# EasyEDA Pro project ProProject_HV Display_2024-06-08.epro

# Schematic Schematic
Create Date: 2024-06-04; Page Name: P1; Project Name: HV Display; Schematic Name: Schematic; Update Date: 2024-06-07; Company: www.fiverr.com/yasirahmad159; Drawn: EasyEDA; Page Size: A4; Part Number: JLCPCB-002; Reviewed: EasyEDA; Version: V0.1
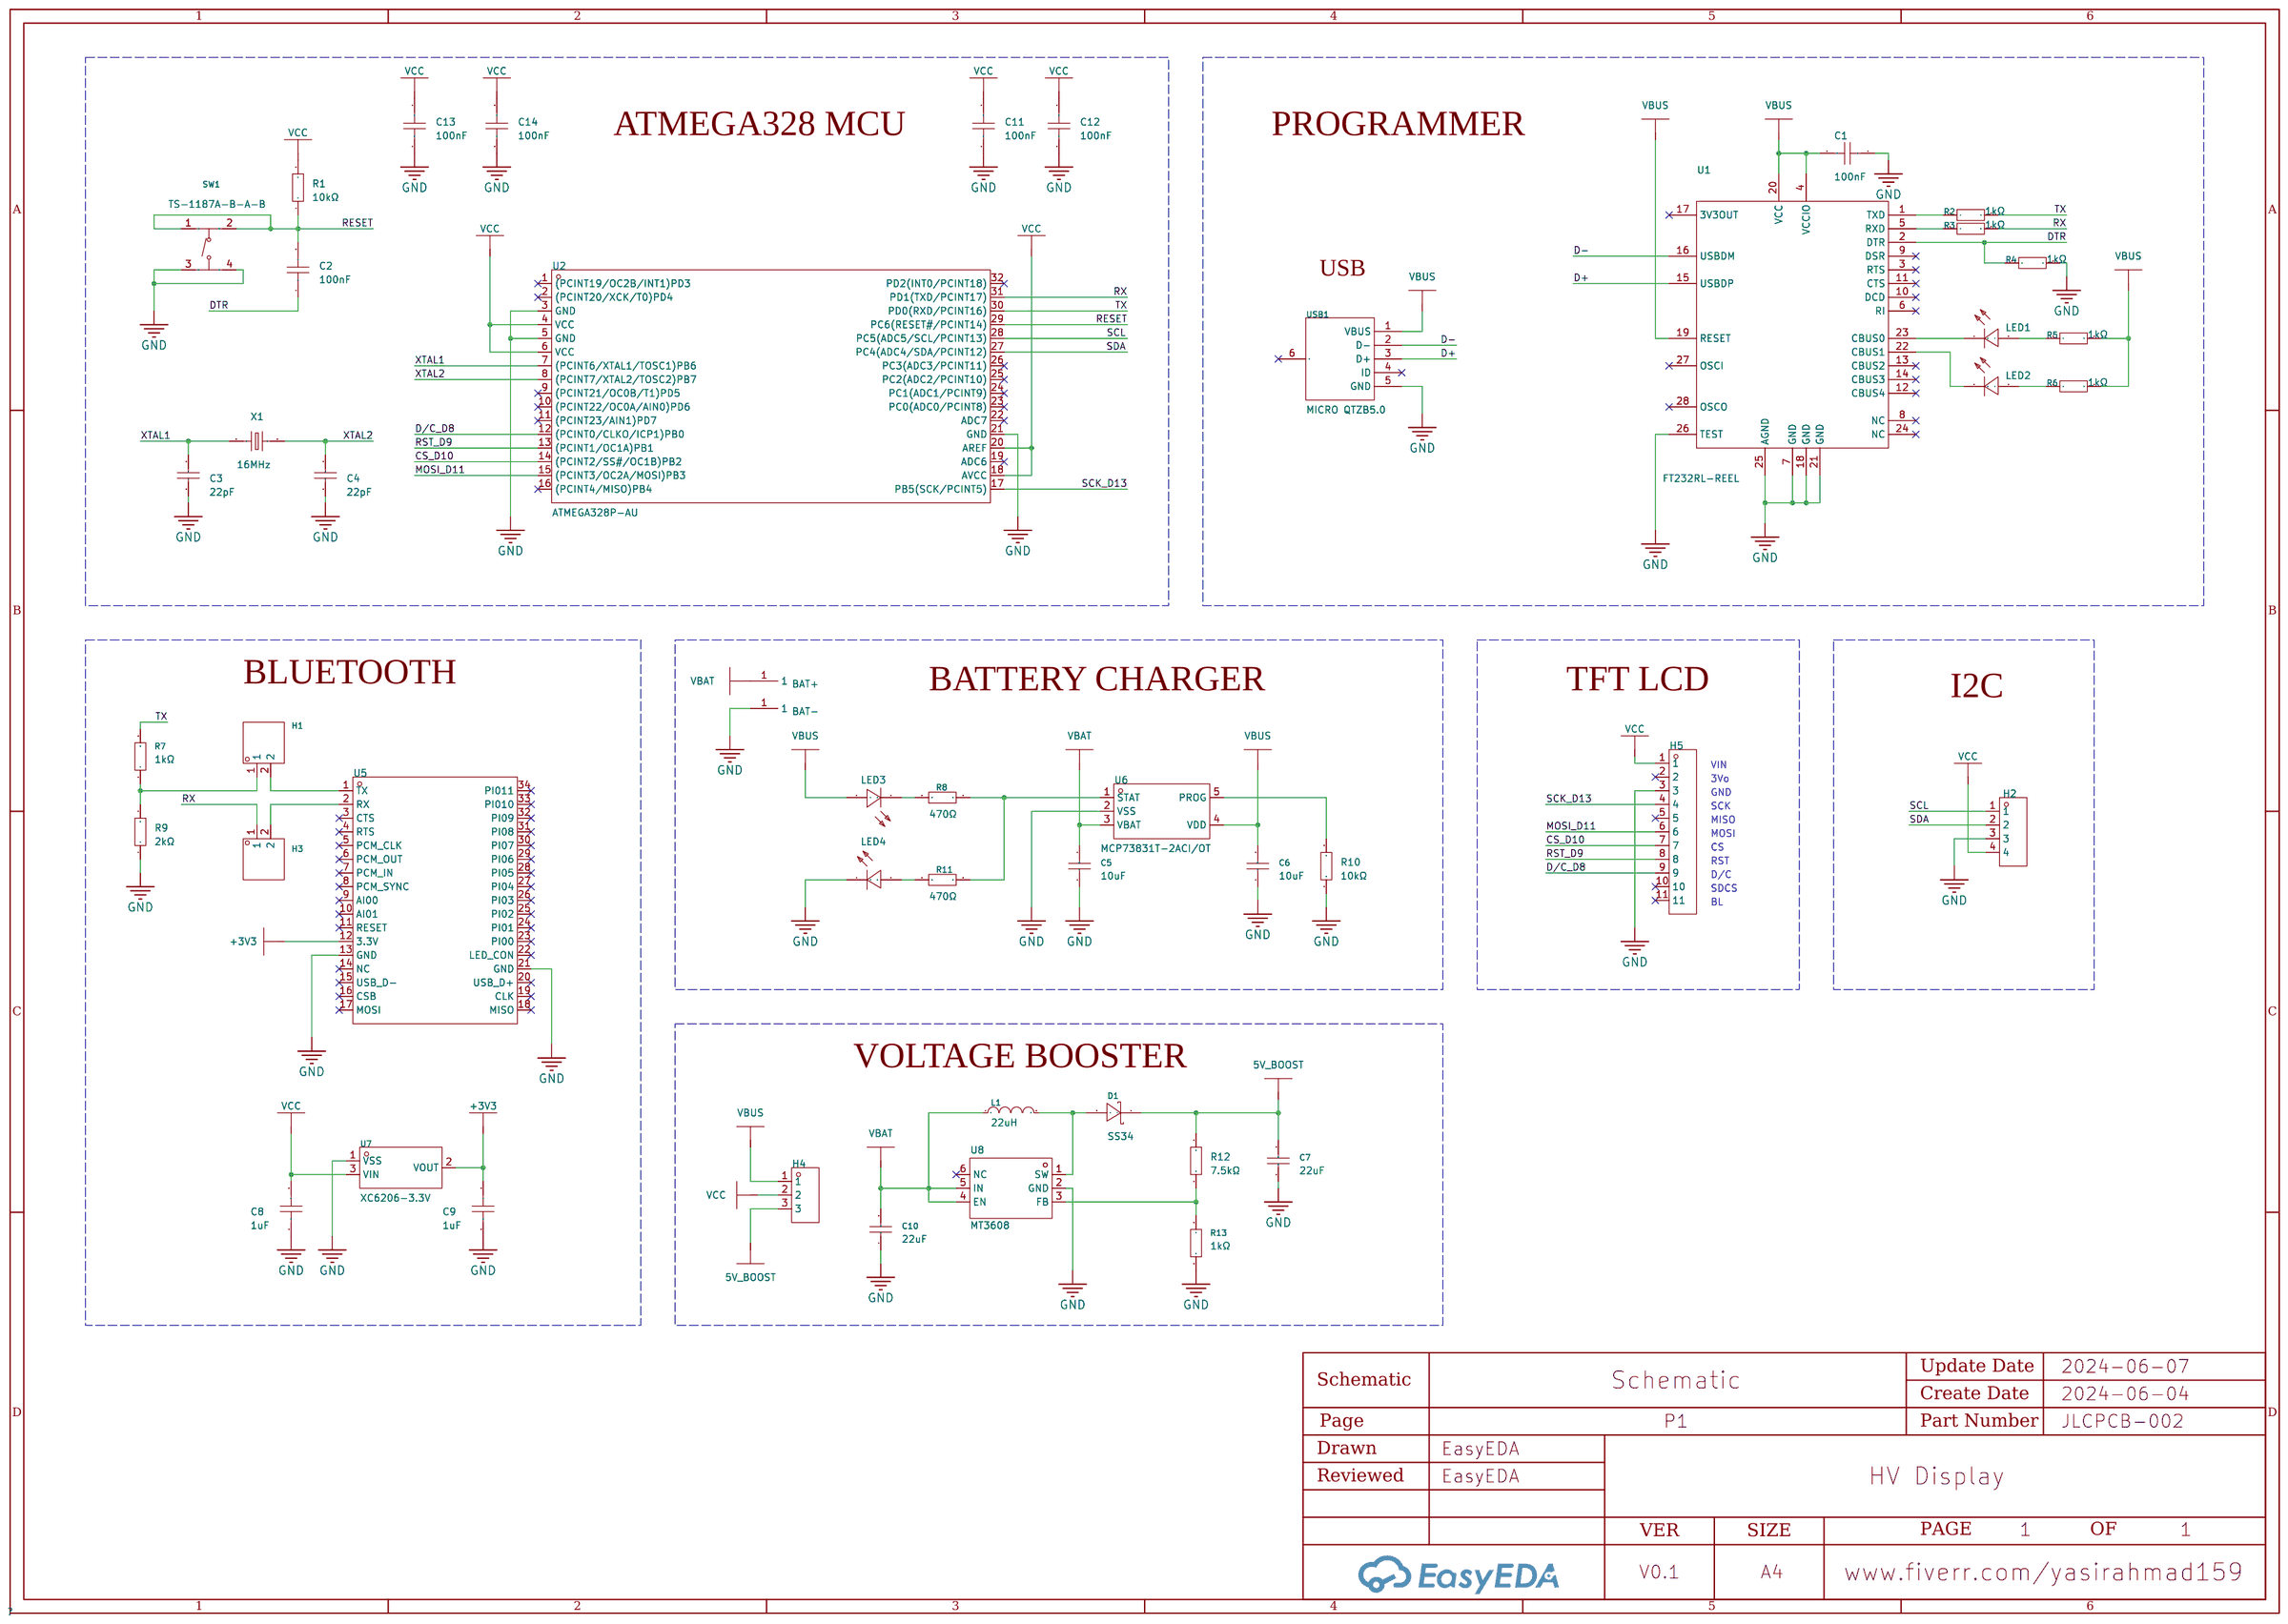
[diagram p0: schematic sheet]

## Parts
C1  100nF  [C0402]
C2  100nF  [C0402]
C3  22pF  [C0402]
C4  22pF  [C0402]
C5  10uF  [C0402]
C6  10uF  [C0402]
C7  22uF  [C1812]
C8  1uF  [C0402]
C9  1uF  [C0402]
C10  22uF  [C1812]
C11  100nF  [C0402]
C12  100nF  [C0402]
C13  100nF  [C0402]
C14  100nF  [C0402]
D1  SS34  [SMA_L4.3-W2.6-LS5.2-RD]
H1  -  [HDR-TH_2P-P2.54-V-M-1]
H2  -  [HDR-TH_4P-P2.54-V-M]
H3  -  [HDR-TH_2P-P2.54-V-M-1]
H4  -  [HDR-TH_3P-P2.54-V-M]
H5  -  [HDR-TH_11P-P2.54-V-M]
L1  22uH  [IND-SMD_L7.0-W6.8]
LED1  TJ-S1005SW4TGLC2R-A5  [LED0402-RD]
LED2  TJ-S1005SW4TGLC2R-A5  [LED0402-RD]
LED3  TJ-S1005SW4TGLC2R-A5  [LED0402-RD]
LED4  TJ-S1005SW4TGLC7K-A5  [LED0402-RD_GREEN]
R1  10kΩ  [R0402]
R2  1kΩ  [R0402]
R3  1kΩ  [R0402]
R4  1kΩ  [R0402]
R5  1kΩ  [R0402]
R6  1kΩ  [R0402]
R7  1kΩ  [R0402]
R8  470Ω  [R0402]
R9  2kΩ  [R0402]
R10  10kΩ  [R0402]
R11  470Ω  [R0402]
R12  7.5kΩ  [R0402]
R13  1kΩ  [R0402]
SW1  TS-1187A-B-A-B  [SW-SMD_4P-L5.1-W5.1-P3.70-LS6.5-TL-2]
U1  FT232RL-REEL  [SSOP-28_L10.2-W5.3-P0.65-LS7.8-BL]
U2  ATMEGA328P-AU  [TQFP-32_L7.0-W7.0-P0.80-LS9.0-BL]
U3  BAT+  [PKG-TEST-POINT-SMD_2.0X2.0]
U4  BAT-  [PKG-TEST-POINT-SMD_2.0X2.0]
U5  -  [BULETM-SMD_HC-05]
U6  MCP73831T-2ACI/OT  [SOT-23-5_L3.0-W1.7-P0.95-LS2.8-BL]
U7  XC6206-3.3V  [SSOT-3_L2.9-W1.6-P0.95-LS2.8-BR]
U8  MT3608  [SOT-23-6_L2.9-W1.6-P0.95-LS2.8-BL]
USB1  MICRO QTZB5.0  [MICRO-USB-SMD_MICRO-QTZB5.0]
X1  16MHz  [HC-49S_L11.4-W4.8]

## Library data of the parts
C1 C2 C11-C14 = CL05B104KB54PNC: Capacitance: Tolerance:±10% Tolerance:±10% Voltage Rated: Temperature Coefficient:; LCSC Part Name: 100nF ±10% 50V; Supplier Part: C307331; Manufacturer: SAMSUNG(三星); Supplier Footprint: 0402; JLCPCB Part Class: Basic Part; Datasheet: https://atta.szlcsc.com/upload/public/pdf/source/20160218/1457707763339.pdf; Supplier: LCSC; Tolerance: ±10%
C3 C4 = 0402CG220J500NT: Capacitance: Tolerance:±5% Tolerance:±5% Voltage Rated: Temperature Coefficient:; LCSC Part Name: 22pF ±5% 50V; Supplier Part: C1555; Manufacturer: FH(风华); Supplier Footprint: 0402; JLCPCB Part Class: Basic Part; Datasheet: https://atta.szlcsc.com/upload/public/pdf/source/20200305/C486355_26A10D38EF8C2A5C37091D0039909270.pdf; Supplier: LCSC; Tolerance: ±5%
C5 C6 = CL05A106MQ5NUNC: Capacitance: Tolerance:±20% Tolerance:±20% Voltage Rated: Temperature Coefficient:; LCSC Part Name: 10uF ±20% 6.3V; Supplier Part: C15525; Manufacturer: SAMSUNG(三星); Supplier Footprint: 0402; JLCPCB Part Class: Basic Part; Datasheet: https://atta.szlcsc.com/upload/public/pdf/source/20220823/2B02EE04F8F211D38A52DCB16EB6BEBA.pdf; Supplier: LCSC; Tolerance: ±20%
C7 C10 = 1812X226K250NT: Capacitance:22uF Tolerance:±10% Tolerance:±10% Voltage Rated: Temperature Coefficient:; LCSC Part Name: 22uF ±10% 25V; Supplier Part: C28504; Manufacturer: FH(风华); Supplier Footprint: 1812; JLCPCB Part Class: Extended Part; Datasheet: https://atta.szlcsc.com/upload/public/pdf/source/20200305/C486355_26A10D38EF8C2A5C37091D0039909270.pdf; Supplier: LCSC; Tolerance: ±10%
C8 C9 = CL05A105KA5NQNC: Capacitance: Tolerance:±10% Tolerance:±10% Voltage Rated: Temperature Coefficient:; LCSC Part Name: 1uF ±10% 25V; Supplier Part: C52923; Manufacturer: SAMSUNG(三星); Supplier Footprint: 0402; JLCPCB Part Class: Basic Part; Datasheet: https://atta.szlcsc.com/upload/public/pdf/source/20160218/1457707763339.pdf; Supplier: LCSC; Tolerance: ±10%
D1 = SS34_C8678: Diode Configuration:Single Forward Voltage (Vf@If):550mV@3A Reverse Voltage (Vr):40V Average Rectified Current (Io):3A Reverse Leakage Current (Ir):500uA@40V; LCSC Part Name: 电压:40V 电流:3A; Supplier Part: C8678; Manufacturer: MDD; Supplier Footprint: SMA(DO-214AC); JLCPCB Part Class: Basic Part; Datasheet: https://atta.szlcsc.com/upload/public/pdf/source/20230314/A80AE34493C69B89E2F4B1712F433538.pdf; Supplier: LCSC; Diode Configuration: Single; Forward Voltage (Vf@If): 550mV@3A; Reverse Voltage (Vr): 40V; Average Rectified Current (Io): 3A; Reverse Leakage Current (Ir): 500uA@40V
H1 H3 = HDR-M_2.54_1x2P: Supplier Footprint: Through
H2 = HDR-M_2.54_1x4P: Supplier Footprint: Through
H4 = HDR-M_2.54_1x3P: Supplier Footprint: Through
H5 = HDR-M_2.54_1x11P: Supplier Footprint: Through
L1 = SMRH74-220MT: Inductance: Tolerance:±20% Tolerance:±20% Rated Current:- Saturation Current (Isat):2.1A DC Resistance (DCR): Type:屏蔽电感; LCSC Part Name: 22uH ±20% 2.1A; Supplier Part: C27442; Manufacturer: SXN(顺翔诺); Supplier Footprint: SMD; JLCPCB Part Class: Extended Part; Datasheet: https://atta.szlcsc.com/upload/public/pdf/source/20210810/BDFBFE50B8A07C1FC066F2D9473ADCAE.pdf; Supplier: LCSC; Tolerance: ±20%; Saturation Current (Isat): 2.1A; Type: 屏蔽电感
LED1-LED3 = TJ-S1005SW4TGLC2R-A5: Emitted Color:Red; LCSC Part Name: 红灯; Supplier Part: C273598; Manufacturer: TOGIALED(统佳); Supplier Footprint: 0402; JLCPCB Part Class: Extended Part; Datasheet: https://atta.szlcsc.com/upload/public/pdf/source/20180904/C273598_1D07E90CD4668CC0D8ECC89225AAD9B4.pdf; Supplier: LCSC; Emitted Color: Red
LED4 = TJ-S1005SW4TGLC7K-A5: Emitted Color:Green-yellow; LCSC Part Name: 普绿/黄绿; Supplier Part: C273601; Manufacturer: TOGIALED(统佳); Supplier Footprint: 0402; JLCPCB Part Class: Extended Part; Datasheet: https://atta.szlcsc.com/upload/public/pdf/source/20180904/C273601_BBC7FFCC280A717DAD7A4CC4AE812583.pdf; Supplier: LCSC; Emitted Color: Green-yellow
R1 R10 = 0402WGF1002TCE: Type:Thick Film Resistors Resistance:10kΩ Tolerance:±1% Tolerance:±1% Power(Watts): Overload Voltage (Max): Temperature Coefficient:±100ppm/℃ Temperature Coefficient:±100ppm/℃ Operating Temperature Range:-55℃~+155℃ Operating Temperature Range:-55℃~+155℃; LCSC Part Name: 10kΩ ±1% 62.5mW 厚膜电阻; Supplier Part: C25744; Manufacturer: UNI-ROYAL(厚声); Supplier Footprint: 0402; JLCPCB Part Class: Basic Part; Datasheet: https://atta.szlcsc.com/upload/public/pdf/source/20200306/C422600_1E6D84923E4A46A82E41ADD87F860B5C.pdf; Supplier: LCSC; Type: Thick Film Resistors; Tolerance: ±1%; Temperature Coefficient: ±100ppm/℃; Operating Temperature Range: -55℃~+155℃
R2-R7 R13 = 0402WGF1001TCE: Type:Thick Film Resistors Resistance:1kΩ Tolerance:±1% Tolerance:±1% Power(Watts): Overload Voltage (Max): Temperature Coefficient:±100ppm/℃ Temperature Coefficient:±100ppm/℃ Operating Temperature Range:-55℃~+155℃ Operating Temperature Range:-55℃~+155℃; LCSC Part Name: 1kΩ ±1% 62.5mW 厚膜电阻; Supplier Part: C11702; Manufacturer: UNI-ROYAL(厚声); Supplier Footprint: 0402; JLCPCB Part Class: Basic Part; Datasheet: https://atta.szlcsc.com/upload/public/pdf/source/20200306/C422600_1E6D84923E4A46A82E41ADD87F860B5C.pdf; Supplier: LCSC; Type: Thick Film Resistors; Tolerance: ±1%; Temperature Coefficient: ±100ppm/℃; Operating Temperature Range: -55℃~+155℃
R8 R11 = 0402WGF4700TCE: Type:Thick Film Resistors Resistance: Tolerance:±1% Tolerance:±1% Power(Watts): Overload Voltage (Max): Temperature Coefficient:±100ppm/℃ Temperature Coefficient:±100ppm/℃ Operating Temperature Range:-55℃~+155℃ Operating Temperature Range:-55℃~+155℃; LCSC Part Name: 470Ω ±1% 62.5mW 厚膜电阻; Supplier Part: C25117; Manufacturer: UNI-ROYAL(厚声); Supplier Footprint: 0402; JLCPCB Part Class: Basic Part; Datasheet: https://atta.szlcsc.com/upload/public/pdf/source/20200306/C422600_1E6D84923E4A46A82E41ADD87F860B5C.pdf; Supplier: LCSC; Type: Thick Film Resistors; Tolerance: ±1%; Temperature Coefficient: ±100ppm/℃; Operating Temperature Range: -55℃~+155℃
R9 = 0402WGF2001TCE: Type:Thick Film Resistors Resistance: Tolerance:±1% Tolerance:±1% Power(Watts): Temperature Coefficient:±100ppm/℃ Temperature Coefficient:±100ppm/℃ Overload Voltage (Max): Operating Temperature Range:-55℃~+155℃ Operating Temperature Range:-55℃~+155℃; Supplier: LCSC; Manufacturer: UNI-ROYAL(厚声); Supplier Part: C4109; JLCPCB Part Class: Basic Part; LCSC Part Name: 厚膜电阻 2kΩ ±1% 62.5mW; Supplier Footprint: 0402; Datasheet: https://atta.szlcsc.com/upload/public/pdf/source/20200306/C422600_1E6D84923E4A46A82E41ADD87F860B5C.pdf; Type: Thick Film Resistors; Tolerance: ±1%; Temperature Coefficient: ±100ppm/℃; Operating Temperature Range: -55℃~+155℃
R12 = WR04X7501FTL: Type:Thick Film Resistors Resistance: Tolerance:±1% Tolerance:±1% Power(Watts): Overload Voltage (Max): Temperature Coefficient:±100ppm/℃ Temperature Coefficient:±100ppm/℃ Operating Temperature Range:-55℃~+155℃ Operating Temperature Range:-55℃~+155℃; LCSC Part Name: 厚膜电阻 7.5kΩ ±1% 62.5mW; Supplier Part: C168247; Manufacturer: Walsin(华新科); Supplier Footprint: 0402; JLCPCB Part Class: Extended Part; Datasheet: https://atta.szlcsc.com/upload/public/pdf/source/20191217/C470037_D99261402F77DA8B1D609223749D445A.pdf; Supplier: LCSC; Type: Thick Film Resistors; Tolerance: ±1%; Temperature Coefficient: ±100ppm/℃; Operating Temperature Range: -55℃~+155℃
SW1 = TS-1187A-B-A-B: Circuit:SPST Actuator Style:Round Button Operating Force:160gf Mounting Style:Brick nogging Switch Length:5.1mm Switch Width:5.1mm Switch Height:1.5mm Strike Gundam:不带 Contact Current:50mA Voltage Rating (DC):12V Insulation Resistance:- Actuator/Cap Color; LCSC Part Name: 5.1*5.1*1.5mm 立贴 轻触开关; Supplier Part: C318884; Manufacturer: XKB Connectivity(中国星坤); Supplier Footprint: SMD; JLCPCB Part Class: Basic Part; Datasheet: https://atta.szlcsc.com/upload/public/pdf/source/20200227/C318890_053E50208A88A7BA1965D8746000774E.pdf; Supplier: LCSC; Circuit: SPST; Actuator Style: Round Button; Operating Force: 160gf; Mounting Style: Brick nogging; Switch Length: 5.1mm; Switch Width: 5.1mm; Switch Height: 1.5mm; Strike Gundam: 不带; Contact Current: 50mA; Voltage Rating (DC): 12V; Actuator/Cap Color: 金色; With Lamp: No; Mechanical Life: 10万次; Operating Temperature: -30℃~+85℃
U1 = FT232RL-REEL: Applications Function:USB转UART Protocol:UART Supply Voltage:3.3V~5.25V Supply Voltage:3.3V~5.25V Operating Temperature:-40℃~+85℃ Operating Temperature:-40℃~+85℃; LCSC Part Name: USB UART IC; Supplier Part: C8690; Manufacturer: FTDI(飞特帝亚); Supplier Footprint: SSOP-28-208mil; JLCPCB Part Class: Extended Part; Datasheet: https://atta.szlcsc.com/upload/public/pdf/source/20130221/1457706592200.pdf; Supplier: LCSC; Applications Function: USB转UART; Protocol: UART; Supply Voltage: 3.3V~5.25V; Operating Temperature: -40℃~+85℃
U2 = ATMEGA328P-AU_C14877: CPU Core:AVR Program Storage Size:32KB RAM Size:2KB GPIO Ports Number:23 Operating Voltage Range:1.8V~5.5V Operating Voltage Range:1.8V~5.5V CPU Maximum Speed:20MHz Program Memory Type:FLASH EEPROM:1KB Operating Temperature Range:-40℃~+85℃ Operating Tempe; LCSC Part Name: 基于AVR增强型RISC架构的低功耗CMOS 8位微控制器; Supplier Part: C14877; Manufacturer: MICROCHIP(美国微芯); Supplier Footprint: TQFP-32(7x7); JLCPCB Part Class: Extended Part; Datasheet: https://atta.szlcsc.com/upload/public/pdf/source/20140621/1457707095197.pdf; Supplier: LCSC; CPU Core: AVR; Program Storage Size: 32KB; RAM Size: 2KB; GPIO Ports Number: 23; Operating Voltage Range: 1.8V~5.5V; CPU Maximum Speed: 20MHz; Program Memory Type: FLASH; EEPROM: 1KB; Operating Temperature Range: -40℃~+85℃; ADC (Bit): 10bit; Peripheral/Function: WDT；PWM；WDT；PWM; Watchdog: 有; Low-Voltage Detect: 有; Internal Oscillator: 有
U3 U4 = TP-黑色测试点: Supplier Part: C9900007426; Supplier Footprint: TESTPOINT-TH_BD-2P-P2.00; JLCPCB Part Class: Extended Part; Supplier: LCSC
U5 = HC-05: Supplier Part: C9900001063; Supplier Footprint: SMD-34_13.0X27.0X1.50P; JLCPCB Part Class: 扩展库; Datasheet: 2021-10-26/262798S/0744a6e575994a8186035cee355055ea/HC-05.pdf; Supplier: LCSC
U6 = MCP73831T-2ACI/OT: Supply Voltage:6V Supply Voltage:6V Maximum Charge Current:500mA Type of Battery:锂离子/Polymer Number of Cells:1 Number of Cells:1 Operating Temperature:-40℃~+85℃ Operating Temperature:-40℃~+85℃; Supplier Part: C424093; Manufacturer: MICROCHIP(美国微芯); Supplier Footprint: SOT-23-5; JLCPCB Part Class: Extended Part; Datasheet: https://atta.szlcsc.com/upload/public/pdf/source/20190902/C424093_BB3CBFD6F009A8554318004A07DA97EE.pdf; Supplier: LCSC; Supply Voltage: 6V; Maximum Charge Current: 500mA; Type of Battery: 锂离子/Polymer; Number of Cells: 1; Operating Temperature: -40℃~+85℃
U7 = XC6206-3.3V_C2891841: Output Type: Maximum Input Voltage:6V Output Voltage:3.3V Output Voltage:3.3V MAX Output Current:250mA Operating Temperature:-40℃~+85℃@(Tj) Operating Temperature:-40℃~+85℃@(Tj) Output Polarity:Positive electrode Number of Outputs:1; LCSC Part Name: 输入6V 输出3.3V 250mA; Supplier Part: C2891841; Manufacturer: YONGYUTAI(永裕泰); Supplier Footprint: SOT-23-3L; JLCPCB Part Class: Extended Part; Datasheet: https://atta.szlcsc.com/upload/public/pdf/source/20210901/DE3C77F0CE73FFE8F7C655BE9B94CB06.pdf; Supplier: LCSC; Maximum Input Voltage: 6V; Output Voltage: 3.3V; MAX Output Current: 250mA; Operating Temperature: -40℃~+85℃@(Tj); Output Polarity: Positive electrode; Number of Outputs: 1
U8 = MT3608: Function:boost converterType Input Voltage:2V~24V Input Voltage:2V~24V Output Voltage:28V Output Voltage:28V Output Current (Max):- Switching Frequency:1.2MHz Synchronous Rectification:- Number of Outputs:1 Topology:Boost Switch tube (built-in/external):内; Supplier Part: C84817; Manufacturer: 西安航天民芯; Supplier Footprint: SOT-23-6; JLCPCB Part Class: Extended Part; Datasheet: https://atta.szlcsc.com/upload/public/pdf/source/20161110/1478743351706.pdf; Supplier: LCSC; Function: boost converterType; Input Voltage: 2V~24V; Output Voltage: 28V; Switching Frequency: 1.2MHz; Number of Outputs: 1; Topology: Boost; Switch tube (built-in/external): 内置
USB1 = MICRO QTZB5.0: Connector Type:Micro-B Standard:USB 2.0 Gender:Female Number of Ports:1 Number of Contacts:5P Mounting Style:卧贴 Current Rating - Power (Max):1A Operating Temperature Range:-30℃~+80℃ Operating Temperature Range:-30℃~+80℃; LCSC Part Name: Micro-B 母 卧贴; Supplier Part: C2681556; Manufacturer: SHOU HAN(首韩); Supplier Footprint: SMD; JLCPCB Part Class: Extended Part; Datasheet: https://atta.szlcsc.com/upload/public/pdf/source/20210107/C2681556_CFA58CC35A80C3AC7F409A47931A5E57.pdf; Supplier: LCSC; Connector Type: Micro-B; Standard: USB 2.0; Gender: Female; Number of Ports: 1; Number of Contacts: 5P; Mounting Style: 卧贴; Current Rating - Power (Max): 1A; Operating Temperature Range: -30℃~+80℃
X1 = TAXM16M2GLFBET2T: Crystal Type:贴片晶振 Frequency: Normal temperature Frequency Tolerance:±30ppm Normal temperature Frequency Tolerance:±30ppm External load capacitor: Frequency Stability(Full temperature range):±30ppm Frequency Stability(Full temperature range):±30ppm Equival; LCSC Part Name: 16MHz ±30ppm 20pF; Supplier Part: C111377; Manufacturer: YJX(雅晶鑫); Supplier Footprint: HC-49S-SMD; JLCPCB Part Class: Extended Part; Datasheet: https://atta.szlcsc.com/upload/public/pdf/source/20190305/C362352_AFD953984E9CF948957766F91AB56AA4.pdf; Supplier: LCSC; Crystal Type: 贴片晶振; Normal temperature Frequency Tolerance: ±30ppm; Frequency Stability(Full temperature range): ±30ppm; Equivalent Series Resistance (ESR): 50Ω

## Nets
5V_BOOST: C7.2 D1.1(K) H4.3 R12.2
+3V3: C9.2 U5.12(3.3V) U7.2(VOUT)
GND: C1.1 C3.1 C4.1 C5.1 C6.1 C7.1 C8.1 C9.1 C10.1 C11.1 C12.1 C13.1 C14.1 H2.3 H5.3 LED4.1(C) R4.2 R9.1 R10.1 R13.1 SW1.3(C) SW1.4(D) U1.7(GND) U1.18(GND) U1.21(GND) U1.25(AGND) U1.26(TEST) U2.3(GND) U2.5(GND) U2.21(GND) U4.1 U5.13(GND) U5.21(GND) U6.2(VSS) U7.1(VSS) U8.2(GND) USB1.5(GND)
VBAT: C5.2 C10.2 L1.1 U3.1 U6.3(VBAT) U8.4(EN) U8.5(IN)
VBUS: C1.2 C6.2 H4.1 LED3.2(A) R5.2 R6.2 U1.4(VCCIO) U1.19(RESET) U1.20(VCC) U6.4(VDD) USB1.1(VBUS)
VCC: C8.2 C11.2 C12.2 C13.2 C14.2 H2.4 H4.2 H5.1 R1.2 U2.4(VCC) U2.6(VCC) U2.18(AVCC) U2.20(AREF) U7.3(VIN)
CS_D10: H5.7 U2.14((PCINT2/SS#/OC1B)PB2)
D+: U1.15(USBDP) USB1.3(D+)
D-: U1.16(USBDM) USB1.2(D-)
D/C_D8: H5.9 U2.12((PCINT0/CLKO/ICP1)PB0)
DTR: C2.1 R4.1 U1.2(DTR)
MOSI_D11: H5.6 U2.15((PCINT3/OC2A/MOSI)PB3)
RESET: C2.2 R1.1 SW1.1(A) SW1.2(B) U2.29(PC6(RESET#/PCINT14))
RST_D9: H5.8 U2.13((PCINT1/OC1A)PB1)
RX: H3.1 R3.2 U2.31(PD1(TXD/PCINT17))
SCK_D13: H5.4 U2.17(PB5(SCK/PCINT5))
SCL: H2.1 U2.28(PC5(ADC5/SCL/PCINT13))
SDA: H2.2 U2.27(PC4(ADC4/SDA/PCINT12))
TX: R2.2 R7.2 U2.30(PD0(RXD/PCINT16))
XTAL1: C3.2 U2.7((PCINT6/XTAL1/TOSC1)PB6) X1.1
XTAL2: C4.2 U2.8((PCINT7/XTAL2/TOSC2)PB7) X1.2
$1N1804: R2.1 U1.1(TXD)
$1N1807: R3.1 U1.5(RXD)
$1N2009: LED1.1(C) U1.23(CBUS0)
$1N2012: LED2.1(C) U1.22(CBUS1)
$1N2054: LED1.2(A) R5.1
$1N2094: LED2.2(A) R6.1
$1N2416: R10.2 U6.5(PROG)
$1N2813: LED3.1(C) R8.1
$1N2870: R8.2 R11.2 U6.1(STAT)
$1N2942: LED4.2(A) R11.1
$1N3284: D1.2(A) L1.2 U8.1(SW)
$1N3556: R12.1 R13.2 U8.3(FB)
$1N4344: H1.2 U5.1(TX)
$1N4348: H3.2 U5.2(RX)
$1N4352: H1.1 R7.1 R9.2

Not connected (* = marked no-connect by the designer): H5 2* 5* 10* 11*; U1 3(RTS)* 6(RI)* 8(NC)* 9(DSR)* 10(DCD)* 11(CTS)* 12(CBUS4)* 13(CBUS2)* 14(CBUS3)* 17(3V3OUT)* 24(NC)* 27(OSCI)* 28(OSCO)*; U2 1((PCINT19/OC2B/INT1)PD3)* 2((PCINT20/XCK/T0)PD4)* 9((PCINT21/OC0B/T1)PD5)* 10((PCINT22/OC0A/AIN0)PD6)* 11((PCINT23/AIN1)PD7)* 16((PCINT4/MISO)PB4)* 19(ADC6)* 22(ADC7)* 23(PC0(ADC0/PCINT8))* 24(PC1(ADC1/PCINT9))* 25(PC2(ADC2/PCINT10))* 26(PC3(ADC3/PCINT11))* 32(PD2(INT0/PCINT18))*; U5 3(CTS)* 4(RTS)* 5(PCM_CLK)* 6(PCM_OUT)* 7(PCM_IN)* 8(PCM_SYNC)* 9(AI00)* 10(AI01)* 11(RESET)* 14(NC)* 15(USB_D-)* 16(CSB)* 17(MOSI)* 18(MISO)* 19(CLK)* 20(USB_D+)* 22(LED_CON)* 23(PI00)* 24(PI01)* 25(PI02)* 26(PI03)* 27(PI04)* 28(PI05)* 29(PI06)* 30(PI07)* 31(PI08)* 32(PI09)* 33(PI010)* 34(PI011)*; U8 6(NC)*; USB1 4(ID)* 6(EH)*

## Notes on the sheet
- ATMEGA328 MCU
- PROGRAMMER
- USB
- BLUETOOTH
- BATTERY CHARGER
- TFT LCD
- I2C
- VIN
- 3Vo
- GND
- MISO
- SCK
- MOSI
- CS
- RST
- D/C
- BL
- SDCS
- VOLTAGE BOOSTER

# Board PCB
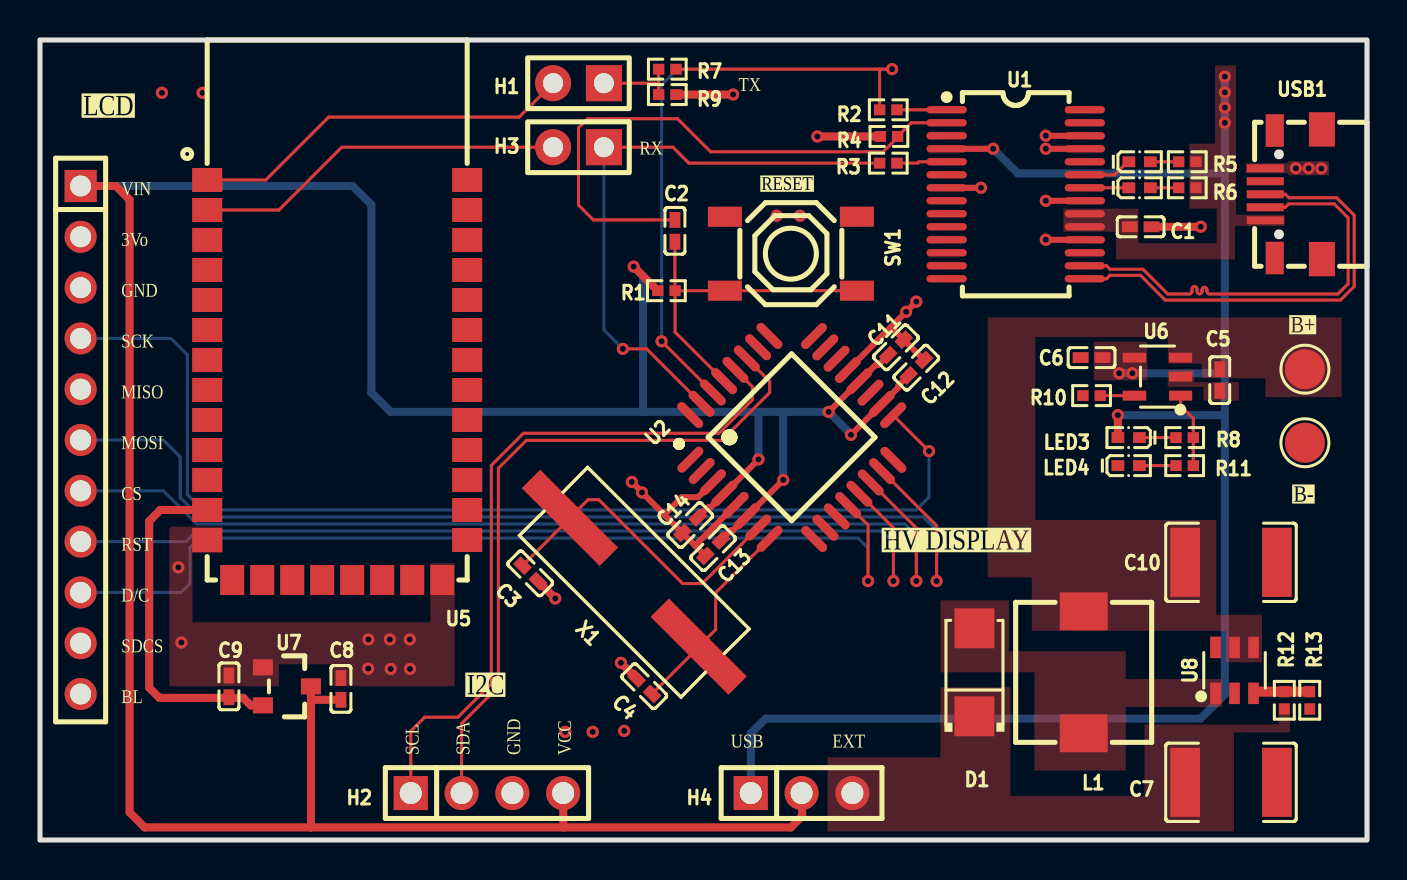
[diagram p1: board, top side]
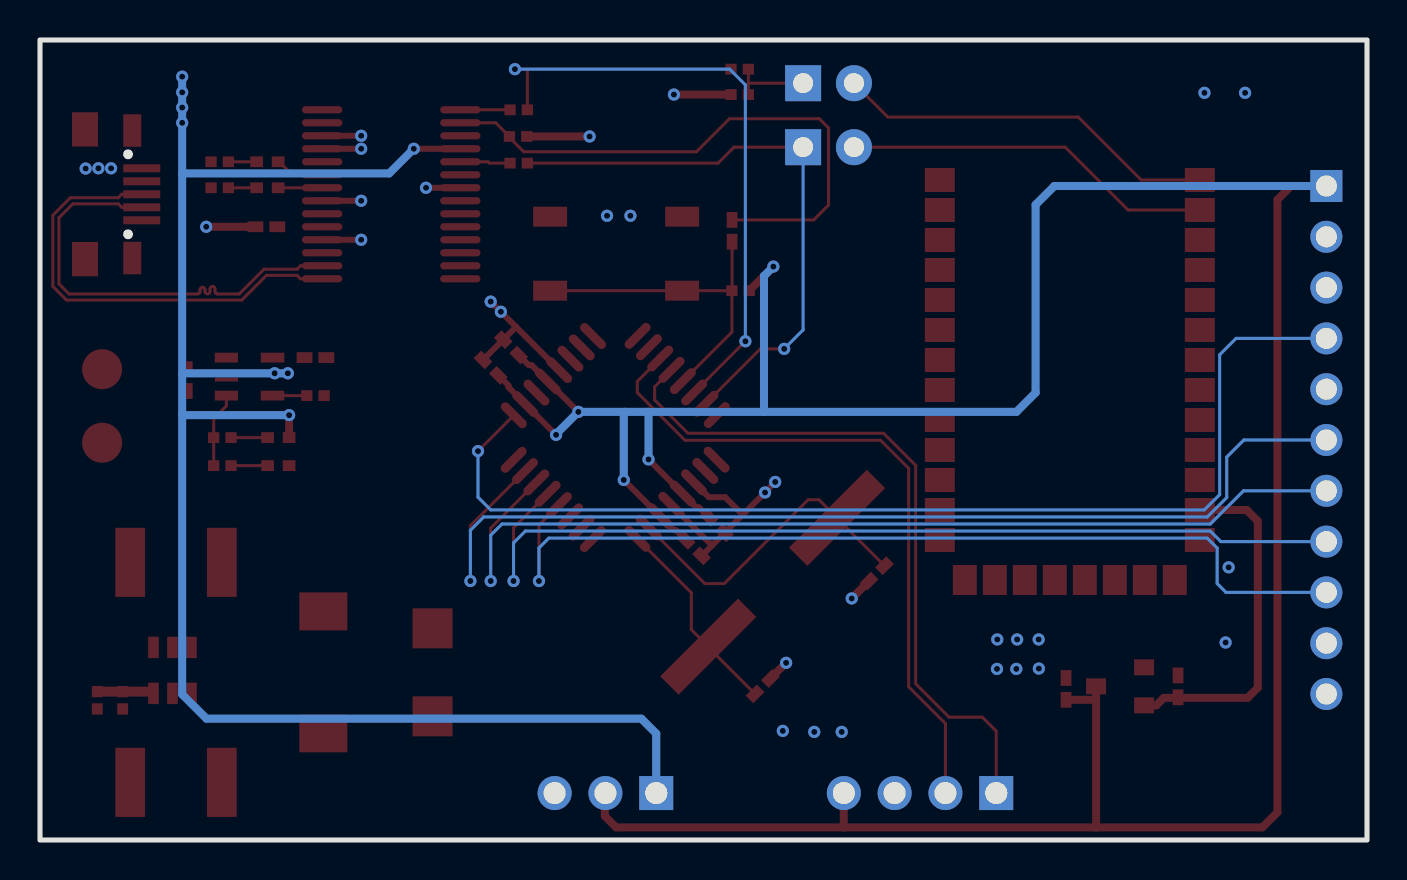
[diagram p2: board, bottom side, seen from below]

Outline 66.35 x 40 mm; copper layers: Top Layer, Bottom Layer. Coordinates in mm from the lower left corner of the outline.
Outline path: rectangle 0,40 66.35,0
Stack: Top Layer 0.035mm / Dielectric1 1.51mm FR4 er 4.5 / Bottom Layer 0.035mm

## Design rules (mm)
net D-: DP1
net D+: DP1
template: Custom Config
spacing copperThickness1oz (default): track to track 0.2, other pairs 0.152 to 0.3
spacing copperThickness2oz: track to track 0.203, other pairs 0.152 to 0.3
track width copperThickness1oz (default): min 0.127, default 0.254, max 2.54
track width copperThickness2oz: min 0.203, default 0.254, max 2.54
differential pair differentialPair (default): width min 0.127, default 0.254, max 2.54; gap min 0.152, default 0.152
via viaSize (default): diameter min 0.5, default 0.6, max 10; hole min 0.3, default 0.3, max 6.3

## Placement (name value [footprint] x y rotation side)
C1  100nF  [C0402]  55.03 30.66 180 top
C2  100nF  [C0402]  31.75 30.46 270 top
C3  22pF  [C0402]  24.51 13.33 135 top
C4  22pF  [C0402]  30.21 7.69 315 top
C5  10uF  [C0402]  58.99 23 90 top
C6  10uF  [C0402]  52.58 24.12 0 top
C7  22uF  [C1812]  59.55 2.88 180 top
C8  1uF  [C0402]  15.05 7.56 270 top
C9  1uF  [C0402]  9.45 7.68 270 top
C10  22uF  [C1812]  59.55 13.88 180 top
C11  100nF  [C0402]  42.8 24.63 225 top
C12  100nF  [C0402]  43.81 23.62 225 top
C13  100nF  [C0402]  33.66 14.59 45 top
C14  100nF  [C0402]  32.51 15.74 45 top
D1  SS34  [SMA_L4.3-W2.6-LS5.2-RD]  46.72 8.38 90 top
H1  -  [HDR-TH_2P-P2.54-V-M-1]  26.92 37.84 180 top
H2  -  [HDR-TH_4P-P2.54-V-M]  22.35 2.35 0 top
H3  -  [HDR-TH_2P-P2.54-V-M-1]  26.92 34.64 180 top
H4  -  [HDR-TH_3P-P2.54-V-M]  38.08 2.35 0 top
H5  -  [HDR-TH_11P-P2.54-V-M]  2.03 20 270 top
L1  22uH  [IND-SMD_L7.0-W6.8]  52.18 8.38 90 top
LED1  TJ-S1005SW4TGLC2R-A5  [LED0402-RD]  54.98 33.91 0 top
LED2  TJ-S1005SW4TGLC2R-A5  [LED0402-RD]  54.98 32.61 0 top
LED3  TJ-S1005SW4TGLC2R-A5  [LED0402-RD]  54.43 20.12 180 top
LED4  TJ-S1005SW4TGLC7K-A5  [LED0402-RD_GREEN]  54.43 18.72 0 top
R1  10kΩ  [R0402]  31.32 27.47 180 top
R2  1kΩ  [R0402]  42.41 36.51 180 top
R3  1kΩ  [R0402]  42.41 33.84 180 top
R4  1kΩ  [R0402]  42.45 35.18 180 top
R5  1kΩ  [R0402]  57.36 33.91 0 top
R6  1kΩ  [R0402]  57.36 32.61 0 top
R7  1kΩ  [R0402]  31.37 38.54 0 top
R8  470Ω  [R0402]  57.23 20.12 0 top
R9  2kΩ  [R0402]  31.37 37.27 180 top
R10  10kΩ  [R0402]  52.58 22.22 0 top
R11  470Ω  [R0402]  57.23 18.72 0 top
R12  7.5kΩ  [R0402]  62.22 6.99 270 top
R13  1kΩ  [R0402]  63.49 6.99 90 top
SW1  TS-1187A-B-A-B  [SW-SMD_4P-L5.1-W5.1-P3.70-LS6.5-TL-2]  37.54 29.32 180 top
U1  FT232RL-REEL  [SSOP-28_L10.2-W5.3-P0.65-LS7.8-BL]  48.79 32.29 270 top
U2  ATMEGA328P-AU  [TQFP-32_L7.0-W7.0-P0.80-LS9.0-BL]  37.59 20.13 315 top
U3  BAT+  [PKG-TEST-POINT-SMD_2.0X2.0]  63.25 23.54 0 top
U4  BAT-  [PKG-TEST-POINT-SMD_2.0X2.0]  63.25 19.86 270 top
U5  -  [BULETM-SMD_HC-05]  14.86 23 0 top
U6  MCP73831T-2ACI/OT  [SOT-23-5_L3.0-W1.7-P0.95-LS2.8-BL]  55.88 23.17 90 top
U7  XC6206-3.3V  [SSOT-3_L2.9-W1.6-P0.95-LS2.8-BR]  12.35 7.68 180 top
U8  MT3608  [SOT-23-6_L2.9-W1.6-P0.95-LS2.8-BL]  59.73 8.48 0 top
USB1  MICRO QTZB5.0  [MICRO-USB-SMD_MICRO-QTZB5.0]  62.68 32.29 90 top
X1  16MHz  [HC-49S_L11.4-W4.8]  29.71 12.89 315 top

## Footprints (pads in the part's own frame, mm; a bottom-side part is the same pattern mirrored in y, then rotated)
BULETM-SMD_HC-05
  rect 1.5x1.2 smd: 1(-6.5,10) 2(-6.5,8.5) 3(-6.5,7) 4(-6.5,5.5) 5(-6.5,4) 6(-6.5,2.5) 7(-6.5,1) 8(-6.5,-0.5) 9(-6.5,-2) 10(-6.5,-3.5) 11(-6.5,-5) 12(-6.5,-6.5) 13(-6.5,-8) 22(6.5,-8) 23(6.5,-6.5) 24(6.5,-5) 25(6.5,-3.5) 26(6.5,-2) 27(6.5,-0.5) 28(6.5,1) 29(6.5,2.5) 30(6.5,4) 31(6.5,5.5) 32(6.5,7) 33(6.5,8.5) 34(6.5,10)
  rect 1.2x1.5 smd: 14(-5.25,-10) 15(-3.75,-10) 16(-2.25,-10) 17(-0.75,-10) 18(0.75,-10) 19(2.25,-10) 20(3.75,-10) 21(5.25,-10)
C0402
  rect 0.79x0.54 smd: 1(-0.545,0) 2(0.545,0)
C1812
  rect 1.485x3.456 smd: 1(-2.292,0) 2(2.292,0)
HC-49S_L11.4-W4.8
  rect 5.5x1.3 smd: 1(-4.553,0) 2(4.553,0)
HDR-TH_2P-P2.54-V-M-1
  rect 1.8x1.8 hole 1: 1(-1.27,0)
  round 1.8 hole 1: 2(1.27,0)
HDR-TH_3P-P2.54-V-M
  rect 1.7x1.7 hole 1.1: 1(-2.54,0)
  round 1.7 hole 1.1: 2(0,0) 3(2.54,0)
HDR-TH_4P-P2.54-V-M
  rect 1.7x1.7 hole 1.1: 1(-3.81,0)
  round 1.7 hole 1.1: 2(-1.27,0) 3(1.27,0) 4(3.81,0)
HDR-TH_11P-P2.54-V-M
  rect 1.6x1.6 hole 1.05: 1(-12.7,0)
  round 1.6 hole 1.05: 2(-10.16,0) 3(-7.62,0) 4(-5.08,0) 5(-2.54,0) 6(0,0) 7(2.54,0) 8(5.08,0) 9(7.62,0) 10(10.16,0) 11(12.7,0)
IND-SMD_L7.0-W6.8
  rect 1.9x2.4 smd: 1(3.048,0) 2(-3.048,0)
LED0402-RD
  rect 0.636x0.54 smd: 1(-0.538,0) 2(0.538,0)
LED0402-RD_GREEN
  rect 0.636x0.54 smd: 1(-0.538,0) 2(0.538,0)
MICRO-USB-SMD_MICRO-QTZB5.0
  rect 0.4x1.85 smd: 1(-1.3,1.417) 2(-0.65,1.417) 3(0,1.417) 4(0.65,1.417) 5(1.3,1.417)
  rect 1.715x1.3 smd: 6(-3.243,-1.417) 6(3.243,-1.417)
  rect 1.625x0.9 smd: 6(-3.188,0.943) 6(3.188,0.943)
PKG-TEST-POINT-SMD_2.0X2.0
  round 2 smd: 1(0,0)
R0402
  rect 0.566x0.54 smd: 1(-0.433,0) 2(0.433,0)
SMA_L4.3-W2.6-LS5.2-RD
  rect 2x2 smd: 1(-2.2,0) 2(2.2,0)
SOT-23-5_L3.0-W1.7-P0.95-LS2.8-BL
  rect 0.49x1.157 smd: 1(-0.95,-1.153) 2(0,-1.153) 3(0.95,-1.153)
  rect 0.49x1.175 smd: 4(0.95,1.153) 5(-0.95,1.153)
SOT-23-6_L2.9-W1.6-P0.95-LS2.8-BL
  rect 0.532x1.072 smd: 1(-0.95,-1.149) 2(0,-1.149) 3(0.95,-1.149) 4(0.95,1.149) 5(0,1.149) 6(-0.95,1.149)
SSOP-28_L10.2-W5.3-P0.65-LS7.8-BL
  oval 0.364x2.015 smd: 1(-4.225,-3.455) 2(-3.575,-3.455) 3(-2.925,-3.455) 4(-2.275,-3.455) 5(-1.625,-3.455) 6(-0.975,-3.455) 7(-0.325,-3.455) 8(0.325,-3.455) 9(0.975,-3.455) 10(1.625,-3.455) 11(2.275,-3.455) 12(2.925,-3.455) 13(3.575,-3.455) 14(4.225,-3.455) 15(4.225,3.455) 16(3.575,3.455) 17(2.925,3.455) 18(2.275,3.455) 19(1.625,3.455) 20(0.975,3.455) 21(0.325,3.455) 22(-0.325,3.455) 23(-0.975,3.455) 24(-1.625,3.455) 25(-2.275,3.455) 26(-2.925,3.455) 27(-3.575,3.455) 28(-4.225,3.455)
SSOT-3_L2.9-W1.6-P0.95-LS2.8-BR
  rect 1x0.8 smd: 1(1.2,-0.95) 2(1.2,0.95) 3(-1.2,0)
SW-SMD_4P-L5.1-W5.1-P3.70-LS6.5-TL-2
  rect 1.7x1 smd: 1(-3.3,1.85) 2(3.3,1.85) 3(-3.3,-1.85) 4(3.3,-1.85)
TQFP-32_L7.0-W7.0-P0.80-LS9.0-BL
  oval 0.45x1.65 smd: 1(-2.8,-4.369) 2(-2,-4.369) 3(-1.2,-4.369) 4(-0.4,-4.369) 5(0.4,-4.369) 6(1.2,-4.369) 7(2,-4.369) 8(2.8,-4.369) 17(2.8,4.369) 18(2,4.369) 19(1.2,4.369) 20(0.4,4.369) 21(-0.4,4.369) 22(-1.2,4.369) 23(-2,4.369) 24(-2.8,4.369)
  oval 1.65x0.45 smd: 9(4.381,-2.8) 10(4.381,-2) 11(4.381,-1.2) 12(4.381,-0.4) 13(4.381,0.4) 14(4.381,1.2) 15(4.381,2) 16(4.381,2.8) 25(-4.381,2.8) 26(-4.381,2) 27(-4.381,1.2) 28(-4.381,0.4) 29(-4.381,-0.4) 30(-4.381,-1.2) 31(-4.381,-2) 32(-4.381,-2.8)

## Nets
As in the schematic.

Pads without a net: H5 2 5 10 11; U1 3 6 8 9 10 11 12 13 14 17 24 27 28; U2 1 2 9 10 11 16 19 22 23 24 25 26 32; U5 3 4 5 6 7 8 9 10 11 14 15 16 17 18 19 20 22 23 24 25 26 27 28 29 30 31 32 33 34; U8 6; USB1 4 6

## Via types
v1: diameter 0.61, hole 0.305, Top Layer to Bottom Layer, 53 vias

## Routing (per net, layer and track width the routed paths; a pad name or vN(x,y) marks a point on that pad's centre or on a via; arc(x,y) is an arc through that point)
+3V3: length 17.6
  Top Layer w0.152: 9.42,7.11 C9.2
  Top Layer w0.4: U7.2 10.53,6.73 10.16,7.11 5.97,7.11 5.46,7.61 5.46,15.95 6.01,16.5 U5.12
GND: length 38.7
  Top Layer w0.3: 40.39,23.5 42.54,25.65 ; 42.54,25.65 42.56,25.65 C11.1 C12.1 ; 42.54,25.65 v1(43.31,26.41) v1(43.81,26.92) ; 34.78,16.75 32.78,14.76 32.72,14.76 ; 31.21,16.26 32.09,17.14 32.9,17.14 U2.3 ; 31.21,16.26 32.72,14.76 ; 31.21,16.26 v1(30.1,17.38) 30.1,17.39 v1(29.59,17.9) ; 32.72,14.76 C13.1 ; U1.21 v1(50.29,31.96) ; U1.25 v1(50.29,34.56) ; U1.7 v1(47.05,32.61) ; U1.18 v1(50.29,30.01) ; U1.26 v1(50.29,35.21)
  Top Layer w0.4: C3.1 v1(25.76,12.08) ; C4.1 v1(29.04,8.86) ; R4.2 v1(38.87,35.18) ; R9.1 v1(34.65,37.27) ; 55.58,30.66 v1(58.04,30.66)
  vias: v1(6.1,37.36) v1(6.92,13.63) v1(7.07,9.88) v1(8.13,37.36) v1(16.42,10.03) v1(16.41,8.57) v1(17.49,10.03) v1(17.53,8.55) v1(18.49,10.03) v1(18.5,8.55) v1(26.26,5.41) v1(27.64,5.41) v1(29.21,5.46) v1(36.83,31.21) v1(38,31.21) v1(62.8,33.59) v1(63.43,33.59) v1(64.07,33.57)
VBUS: length 84.6
  Top Layer w0.3: U1.4 v1(47.66,34.56)
  Top Layer w0.4: v1(53.89,21.24) LED3.2
  Bottom Layer w0.4: v1(47.66,34.56) 48.89,33.33 59.24,33.33 ; v1(53.96,23.34) v1(54.62,23.34) 59.23,23.34 59.24,23.32 ; 59.24,33.33 59.24,23.32 ; 59.24,33.33 v1(59.24,35.86) v1(59.24,36.62) v1(59.24,37.38) v1(59.24,38.17) ; 59.24,23.32 59.24,21.22 ; 59.24,21.22 59.24,7.28 58.02,6.06 36.28,6.06 35.54,5.32 H4.1 ; 59.24,21.22 59.22,21.24 v1(53.89,21.24)
VCC: length 160.1
  Top Layer w0.152: v1(39.43,21.41) 39.43,21.41
  Top Layer w0.3: v1(40.55,20.26) U2.18 42.93,22.64 42.93,22.73 C12.2 ; C11.2 41.91,23.74 41.77,23.74 U2.20 v1(39.43,21.41) ; C13.2 34.04,14.99 34.54,15.49 34.65,15.49 U2.6 v1(37.16,18) ; C14.2 33.4,16.63 33.53,16.63 U2.4 v1(35.92,19.03)
  Top Layer w0.4: H4.2 38.11,2.32 38.11,1.2 37.54,0.63 26.16,0.63 ; 13.55,6.99 13.57,7.01 C8.2 ; 13.55,6.99 13.55,0.64 13.54,0.63 ; 13.55,6.99 U7.3 ; H2.4 26.16,2.34 26.16,0.63 ; 13.54,0.63 5.23,0.63 4.48,1.38 4.48,32.02 3.79,32.7 H5.1 ; 13.54,0.63 26.16,0.63 ; R1.2 v1(29.68,28.67)
  Bottom Layer w0.4: 30.15,21.41 35.94,21.41 ; 30.15,21.41 30.15,28.2 v1(29.68,28.67) ; 30.15,21.41 17.53,21.41 16.57,22.36 16.57,31.76 15.63,32.7 H5.1 ; 35.94,21.41 35.92,21.39 v1(35.92,19.03) ; 35.94,21.41 37.14,21.41 ; v1(40.55,20.26) 40.55,20.29 v1(39.43,21.41) 37.14,21.41 ; v1(37.16,18) 37.16,21.38 37.14,21.41
CS_D10: length 50.9
  Top Layer w0.152: 41.53,17.88 43.81,15.6 v1(43.81,12.95)
  Bottom Layer w0.152: H5.7 6.17,17.46 7.83,15.8 43.25,15.8 43.81,15.23 v1(43.81,12.95)
D+: length 22.8
  Top Layer w0.152: U1.15 53.33,28.06 53.5,28.23 55.02,28.23 56.26,27 65.02,27 65.71,27.68 65.71,31.24 64.83,32.11 62.44,32.11 62.26,32.29 USB1.3
D-: length 22.8
  Top Layer w0.152: U1.16 53.33,28.71 53.5,28.54 55.15,28.54 56.39,27.3 57.47,27.3 arc(57.56,27.34) 57.6,27.42 57.6,27.56 arc(57.72,27.68) 57.85,27.56 57.85,27.42 arc(57.97,27.3) 58.1,27.42 58.1,27.51 arc(58.22,27.64) 58.35,27.51 58.35,27.42 arc(58.39,27.34) 58.47,27.3 64.9,27.3 65.41,27.81 65.41,31.11 64.71,31.81 62.44,31.81 62.26,31.64 USB1.2
D/C_D8: length 47.6
  Top Layer w0.152: v1(41.4,12.95) 41.4,15.75 U2.12
  Bottom Layer w0.152: v1(41.4,12.95) 41.4,14.6 40.91,15.09 7.99,15.09 7.49,14.6 7.49,12.82 7.05,12.38 H5.9
DTR: length 28.9
  Top Layer w0.152: C2.1 27.67,31 26.92,31.75 26.92,35.6 27.38,36.06 31.88,36.06 33.53,34.41 42.16,34.41 42.88,35.13 R4.1 43.56,35.86 U1.2
MOSI_D11: length 55
  Top Layer w0.152: v1(44.83,12.95) 44.83,15.71 U2.15
  Bottom Layer w0.152: H5.6 6.16,20 7.01,19.14 7.01,17.12 7.98,16.15 44.17,16.15 44.83,15.49 v1(44.83,12.95)
RESET: length 17.1
  Top Layer w0.152: C2.2 31.75,27.47 R1.1 ; U2.29 31.75,25.4 R1.1 ; R1.1 40.84,27.47
RST_D9: length 48.1
  Top Layer w0.152: U2.13 42.67,15.61 v1(42.67,12.95)
  Bottom Layer w0.152: H5.8 7.3,14.92 7.83,15.45 42.08,15.45 42.67,14.85 v1(42.67,12.95)
RX: length 29.7
  Top Layer w0.152: H3.1 31.65,34.64 32.45,33.84 R3.2 ; v1(29.14,24.56) 30.33,24.56 33.08,21.81
  Bottom Layer w0.152: v1(29.14,24.56) 28.19,25.5 H3.1
SCK_D13: length 55.2
  Top Layer w0.152: U2.17 v1(44.45,19.44)
  Bottom Layer w0.152: v1(44.45,19.44) 44.45,17.14 43.81,16.5 8.13,16.5 7.37,17.27 7.37,24.26 6.55,25.08 H5.4
SCL: length 35.3
  Top Layer w0.152: U2.28 35.62,22.66 35.62,22.01 33.95,20.34 24.17,20.34 22.57,18.73 22.57,7.81 20.9,6.14 19.24,6.14 18.54,5.44 H2.1
SDA: length 34.3
  Top Layer w0.152: H2.2 21.08,5.82 22.92,7.67 22.92,18.59 24.32,19.98 34.1,19.98 36.48,22.37 36.48,22.93 U2.27
TX: length 41.1
  Top Layer w0.152: R2.2 41.98,38.53 41.97,38.54 ; 41.97,38.54 v1(42.6,38.54) ; 41.97,38.54 R7.2 ; U2.30 v1(31.08,24.94)
  Bottom Layer w0.152: v1(31.08,24.94) 31.08,37.76 31.87,38.54 v1(42.6,38.54)
XTAL1: length 16.1
  Top Layer w0.152: C3.2 26.5,16.08 26.5,16.11 27.4,17.01 27.94,17.01 32.13,12.82 33.11,12.82 U2.7
XTAL2: length 10.2
  Top Layer w0.152: C4.2 32.93,9.64 X1.2 33.78,10.52 33.78,12.36 36.48,15.06
$1N1804: length 2.5
  Top Layer w0.152: 42.85,36.51 45.33,36.51
$1N1807: length 2.5
  Top Layer w0.152: U1.5 43.95,33.91 43.88,33.84 42.85,33.84
$1N2009: length 2.5
  Top Layer w0.152: LED1.1 54.39,33.91 53.74,33.26 U1.23
$1N2012: length 2.2
  Top Layer w0.152: U1.22 LED2.1
$1N2054: length 1.4
  Top Layer w0.152: LED1.2 R5.1
$1N2094: length 1.4
  Top Layer w0.152: LED2.2 R6.1
$1N2416: length 1.7
  Top Layer w0.152: R10.2 U6.5
$1N2813: length 1.8
  Top Layer w0.152: LED3.1 R8.1
$1N2870: length 3.8
  Top Layer w0.152: R11.2 R8.2 57.66,21.07 57.03,21.7 U6.1
$1N2942: length 1.8
  Top Layer w0.152: LED4.2 R11.1
$1N3556: length 2.8
  Top Layer w0.5: U8.3 60.76,7.42 R12.1 R13.2
$1N4344: length 19.3
  Top Layer w0.152: H1.2 23.96,36.15 14.43,36.15 11.29,33 U5.1
$1N4348: length 18.6
  Top Layer w0.152: U5.2 11.95,31.5 15.09,34.64 H3.2
$1N4352: length 4
  Top Layer w0.152: 30.93,37.85 30.92,37.84 H1.1 ; 30.93,37.85 R9.2 ; 30.93,37.85 R7.1

## Copper pours and planes (outline as drawn; the poured copper is in the pictures)
5V_BOOST on Top Layer: 39.38,7.64 62.49,7.64 62.49,0.43 39.38,0.43
GND on Top Layer: 0,40 66.35,40 66.35,0 0,0
GND on Top Layer: 56.39,23.49 59.94,23.49 59.94,21.97 56.39,21.97
GND on Top Layer: 60.28,33.94 64.45,33.94 64.45,33.23 60.28,33.23
GND on Top Layer: 6.46,15.67 20.73,15.67 20.73,7.69 6.46,7.69
GND on Bottom Layer: 0,40 66.35,40 66.35,0 0,0
VBAT on Top Layer: 47.38,26.13 65.08,26.13 65.08,8.89 47.38,8.89
VBUS on Top Layer: 52.69,24.91 55.36,24.91 55.36,22.98 52.69,22.98
VBUS on Top Layer: 51.16,38.73 62.24,38.73 62.24,29.03 51.16,29.03
$1N3284 on Top Layer: 45.02,11.98 59.11,11.98 59.11,3.47 45.02,3.47

## Text on the board
Top Silkscreen Layer: SCL | SDA | GND | VCC | VIN | 3Vo | SCK | MISO | MOSI | CS | RST | D/C | SDCS | BL | RX | USB | TX | RESET | EXT | B+ | B- | LCD | I2C | HV DISPLAY
